# Altium project Micromouse2019.PrjPcb
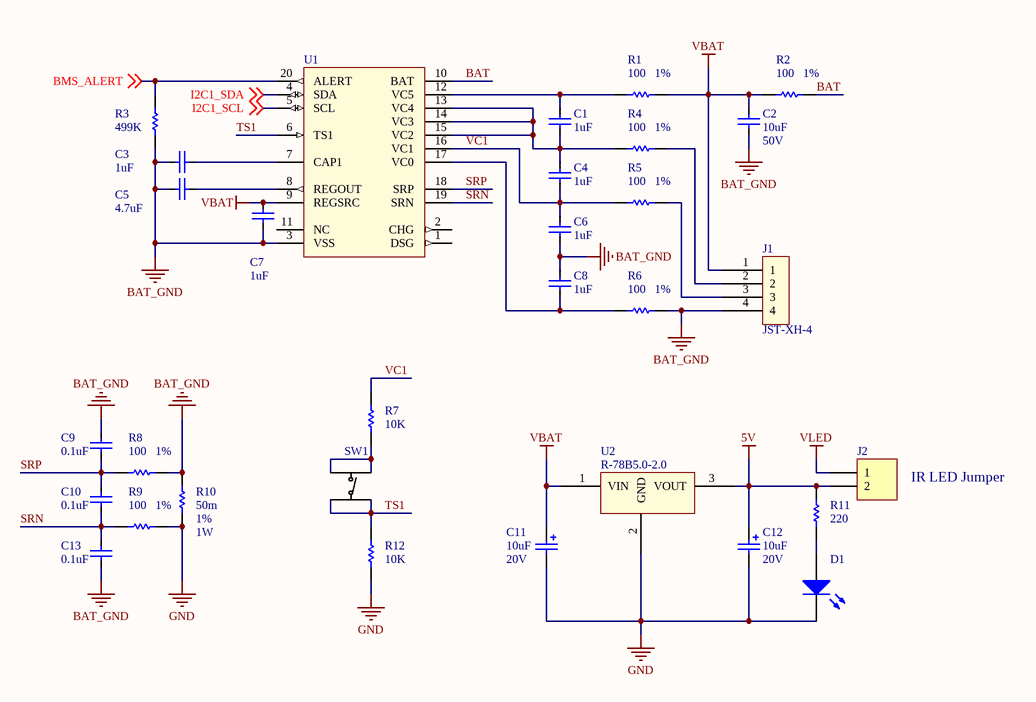
[diagram p0: Battery Management.SchDoc]
4 sheets, 84 parts. Net scope: global (net labels, ports and power ports of the same name join across sheets).
Board file: Micromouse2019.PcbDoc
Sheets:
  Battery Management.SchDoc
  Beaglebone.SchDoc
  Motor Drivers.SchDoc
  Peripherals.SchDoc

## Sheet Battery Management.SchDoc
size A

### Parts
C1  value 1uF  [C0805]  (hidden comment: CAP)
C2  value 10uF  Voltage - Rated: 50V  [1206]  (hidden comment: CAP)
C3  value 1uF  [C0805]  (hidden comment: CAP)
C4  value 1uF  [C0805]  (hidden comment: CAP)
C5  value 4.7uF  [C0805]  (hidden comment: CAP)
C6  value 1uF  [C0805]  (hidden comment: CAP)
C7  value 1uF  [C0805]  (hidden comment: CAP)
C8  value 1uF  [C0805]  (hidden comment: CAP)
C9  value 0.1uF  [J1-0603]  (hidden comment: CAP)
C10  value 0.1uF  [J1-0603]  (hidden comment: CAP)
C11  value 10uF  Voltage Rating: 20V  [1206+]  (hidden comment: CAP POL)
C12  value 10uF  Voltage Rating: 20V  [1206+]  (hidden comment: CAP POL)
C13  value 0.1uF  [J1-0603]  (hidden comment: CAP)
D1  LED  [0603-DI-GREEN]  (value not drawn)
J1  JST-XH-4  [JST-XH-4]
J2  Header 2  [HDR1X2]  (value not drawn)
R1  value 100  Tolerance: 1%  [J1-0603]
R2  value 100  Tolerance: 1%  [J1-0603]
R3  value 499K  [J1-0603]
R4  value 100  Tolerance: 1%  [J1-0603]
R5  value 100  Tolerance: 1%  [J1-0603]
R6  value 100  Tolerance: 1%  [J1-0603]
R7  value 10K  [J1-0603]
R8  value 100  Tolerance: 1%  [J1-0603]
R9  value 100  Tolerance: 1%  [J1-0603]
R10  value 50m  Tolerance: 1%  Power Rating: 1W  [RESC6332]
R11  value 220  [J1-0603]
R12  value 10K  [J1-0603]
SW1  TACT SWITCH  [TACT SWITCH]  (value not drawn)
U1  bq76920  [TSSOP20]  (value not drawn)
U2  Manufacturer Part Number: R-78B5.0-2.0  [SIP-3]  (hidden comment: R-78BXX-XX)

### Nets
5V: C12.1 J2.2 R11.1 U2.3(VOUT)
BAT_GND: C2.2 C3.1 C5.2 C6.1 C7.1 C8.2 C9.2 C13.1 J1.4 R3.1 R6.1 R8.1 R10.1 U1.3(VSS)
GND: C11.2 C12.2 D1.2(K) R9.1 R10.2 R12.2 U2.2(GND)
VBAT: C2.1 C7.2 C11.1 J1.1 R1.1 R2.2 U1.9(REGSRC) U2.1(VIN)
VLED: J2.1
BAT: R2.1 U1.10(BAT)
BMS_ALERT: R3.2 U1.20(ALERT) ; off-sheet BMS_ALERT
I2C1_SCL: U1.5(SCL) ; off-sheet I2C1_SCL
I2C1_SDA: U1.4(SDA) ; off-sheet I2C1_SDA
SRN: C10.1 C13.2 R9.2 U1.19(SRN)
SRP: C9.1 C10.2 R8.2 U1.18(SRP)
TS1: R12.1 SW1.3 SW1.4 U1.6(TS1)
VC1: C4.1 C6.2 R5.2 R7.1 U1.16(VC1)
NetC1_1: C1.1 C4.2 R4.2 U1.13(VC4) U1.14(VC3) U1.15(VC2)
NetC1_2: C1.2 R1.2 U1.12(VC5)
NetC3_2: C3.2 U1.7(CAP1)
NetC5_1: C5.1 U1.8(REGOUT)
NetC8_1: C8.1 R6.2 U1.17(VC0)
NetD1_1: D1.1(A) R11.2
NetJ1_2: J1.2 R4.1
NetJ1_3: J1.3 R5.1
NetR7_2: R7.2 SW1.1 SW1.2

Not connected (* = marked no-connect by the designer): U1 1(DSG) 2(CHG) 11(NC)

### Notes on the sheet
- IR LED Jumper

### Library data of the parts
C1 C3 C4 C6-C8 = CAP: CAP CER 1UF 25V X7R 0805; Manufacturer: Murata Electronics North America; Manufacturer Part Number: GCM21BR71E105KA56L; Tolerance: ±10%; Supplier 1: Digi-Key; Supplier Part Number 1: 490-4785-1-ND; RoHS: RoHS Compliant; Category: Capacitors; Stock 1: 30000; Pricing 1: 1=0.29, 10=0.198, 100=0.1122, 500=0.07918, 1000=0.06927 (USD); Packaging: Cut Tape (CT); Part Status: Active; Voltage - Rated: 25V; Temperature Coefficient: X7R; Operating Temperature: -55°C ~ 125°C; Features: -; Ratings: AEC-Q200; Applications: Automotive; Mounting Type: Surface Mount, MLCC; Package / Case: 0805 (2012 Metric); Size / Dimension: 0.079" L x 0.049" W (2.00mm x 1.25mm); Height - Seated (Max): -; Thickness (Max): 0.055" (1.40mm); Lead Spacing: -; Lead Style: -; ComponentLink1URL: http://search.murata.co.jp/Ceramy/image/img/A01X/G101/ENG/GCM21BR71E105KA56-01.pdf; ComponentLink1Description: http://search.murata.co.jp/Ceramy/image/img/A01X/G101/ENG/GCM21BR71E105KA56-01.pdf
C2 = CAP: CAP CER 10UF 50V X5R 1206; Manufacturer: Murata Electronics North America; Manufacturer Part Number: GRT31CR61H106KE01L; Tolerance: ±10%; Supplier 1: Digi-Key; Supplier Part Number 1: 490-12456-1-ND; RoHS: RoHS Compliant; Category: Capacitors; Stock 1: 20000; Pricing 1: 1=0.89, 10=0.633, 100=0.4166, 500=0.30856, 1000=0.26228 (USD); Packaging: Cut Tape (CT); Part Status: Active; Temperature Coefficient: X5R; Operating Temperature: -55°C ~ 85°C; Features: -; Ratings: AEC-Q200; Applications: Automotive; Mounting Type: Surface Mount, MLCC; Package / Case: 1206 (3216 Metric); Size / Dimension: 0.126" L x 0.063" W (3.20mm x 1.60mm); Height - Seated (Max): -; Thickness (Max): 0.071" (1.80mm); Lead Spacing: -; Lead Style: -; ComponentLink1URL: http://search.murata.co.jp/Ceramy/image/img/A01X/G101/ENG/GRT31CR61H106KE01-01.pdf; ComponentLink1Description: http://search.murata.co.jp/Ceramy/image/img/A01X/G101/ENG/GRT31CR61H106KE01-01.pdf
C5 = CAP: CAP CER 4.7UF 10V X7R 0805; Manufacturer: Samsung Electro-Mechanics; Manufacturer Part Number: CL21B475KPFNNNE; Tolerance: ±10%; Notification: Current market demand for these product types have resulted in fluctuating and extending lead times. Lead times may differ.; Supplier 1: Digi-Key; Supplier Part Number 1: 1276-2972-1-ND; RoHS: RoHS Compliant; Category: Capacitors; Stock 1: 20000; Pricing 1: 1=0.28, 10=0.19, 100=0.0963, 500=0.06588, 1000=0.05828 (USD); Packaging: Cut Tape (CT); Part Status: Active; Voltage - Rated: 10V; Temperature Coefficient: X7R; Operating Temperature: -55°C ~ 125°C; Features: -; Ratings: -; Applications: General Purpose; Mounting Type: Surface Mount, MLCC; Package / Case: 0805 (2012 Metric); Size / Dimension: 0.079" L x 0.049" W (2.00mm x 1.25mm); Height - Seated (Max): -; Thickness (Max): 0.053" (1.35mm); Lead Spacing: -; Lead Style: -; ComponentLink1URL: http://www.samsungsem.com/kr/support/product-search/mlcc/CL21B475KPFNNNE.jsp; ComponentLink1Description: http://www.samsungsem.com/kr/support/product-search/mlcc/CL21B475KPFNNNE.jsp
C9 C10 C13 = CAP: CAP CER 0.1UF 50V X7R 0603; Supplier Part Number 1: 399-6856-1-ND; Voltage Rating: 50V; Supplier 1: Digi-Key
C11 C12 = CAP POL: CAP TANT 10UF 10% 20V 1206; Published: 8-Jun-2000; LatestRevisionDate: 17-Jul-2002; LatestRevisionNote: Re-released for DXP Platform.; PackageReference: RB7.6-15; Publisher: Altium Limited; PackageDescription: Polarized Capacitor (Radial); 2 Leads; Supplier Part Number 1: 478-8273-1-ND; Supplier 1: Digi-Key
D1 = LED: LED GREEN CLEAR CHIP SMD; Published: 8-Jun-2000; LatestRevisionDate: 17-Jul-2002; LatestRevisionNote: Re-released for DXP Platform.; PackageVersion: Feb-2002; PackageReference: 3.2X1.6X1.1; Publisher: Altium Limited; PackageDescription: SM LED; 2 Flat Leads; Supplier Part Number 1: 160-1888-1-ND; Supplier 1: Digi-Key
J1 = JST-XH-4: CONN HEADER R/A 4POS 2.5MM; Manufacturer: JST Sales America Inc.; Manufacturer Part Number: S4B-XH-A(LF)(SN); Pitch - Mating: 0.098" (2.50mm); Number of Positions: 4; Number of Positions Loaded: All; Style: Board to Cable/Wire; Shrouding: Shrouded - 4 Wall; Contact Length - Post: 0.134" (3.40mm); Material Flammability Rating: UL94 V-0; Current Rating: 3A; Voltage Rating: 250V; Mated Stacking Heights: 6.1mm; Supplier 1: Digi-Key; RoHS: RoHS Compliant; Category: Connectors, Interconnects; Stock 1: 46156; Pricing 1: 1=0.27, 10=0.257, 100=0.1785, 500=0.151, 1000=0.12355, 5000=0.10982, 10000=0.09953 (USD); Packaging: Bulk; Part Status: Active; Connector Type: Header; Contact Type: Male Pin; Number of Rows: 1; Row Spacing - Mating: -; Mounting Type: Through Hole, Right Angle; Termination: Press-Fit, Solder; Fastening Type: Detent Lock; Contact Length - Mating: -; Overall Contact Length: -; Insulation Height: 0.240" (6.10mm); Contact Shape: Square; Contact Finish - Mating: Tin; Contact Finish Thickness - Mating: -; Contact Finish - Post: Tin; Contact Material: Brass; Insulation Material: Polyamide (PA66), Nylon 6/6; Features: -; Operating Temperature: -25°C ~ 85°C; Ingress Protection: -; Insulation Color: Natural; Contact Finish Thickness - Post: -; Applications: -; ComponentLink1URL: http://www.jst-mfg.com/product/pdf/eng/eXH.pdf; ComponentLink1Description: http://www.jst-mfg.com/product/pdf/eng/eXH.pdf; Supplier Part Number 1: 455-2243-ND
J2 = Header 2: Header, 2-Pin; LatestRevisionDate: 17-Jul-2002; LatestRevisionNote: Re-released for DXP Platform.; Publisher: Altium Limited
R1 R2 R4-R6 R8 R9 = Res1: RES SMD 100 OHM 1% 1/10W 0603; Supplier Part Number 1: 311-100HRCT-ND; Supplier 1: Digi-Key
R3 = Res1: RES SMD 499K OHM 1% 1/10W 0603; Supplier Part Number 1: 311-499KHRCT-ND; Supplier 1: Digi-Key
R7 R12 = Res1: RES SMD 10K OHM 5% 1/10W 0603; Supplier Part Number 1: 311-10KGRCT-ND; Supplier 1: Digi-Key
R10 = Res1: RES 0.05 OHM 1% 1W 2512; Supplier Part Number 1: 311-0.05TCT-ND; Supplier 1: Digi-Key
R11 = Res1: RES SMD 220 OHM 5% 1/10W 0603; Supplier Part Number 1: 311-220GRCT-ND; Supplier 1: Digi-Key
SW1 = TACT SWITCH: SWITCH TACTILE SPST-NO 0.05A 12V; Manufacturer: C&K; Manufacturer Part Number: PTS645SL50SMTR92 LFS; Switch Function: Off-Mom; Contact Rating @ Voltage: 0.05A @ 12VDC; Actuator Type: Standard; Actuator Height off PCB, Vertical: 5.00mm; Actuator Orientation: Top Actuated; Outline: 6.00mm x 6.00mm; Illumination: Non-Illuminated; Operating Force: 130gf; Actuator Material: Polyamide (PA66), Nylon 6/6; Mechanical Life: 100,000 Cycles; Supplier 1: Digi-Key; RoHS: RoHS Compliant; Category: Switches; Stock 1: 42939; Pricing 1: 1=0.22, 10=0.215, 25=0.2076, 50=0.2002, 100=0.1891, 250=0.17796, 500=0.17054 (USD); Packaging: Cut Tape (CT); Part Status: Active; Circuit: SPST-NO; Mounting Type: Surface Mount; Actuator Length, Right Angle: -; Termination Style: Gull Wing; Illumination Type, Color: -; Illumination Voltage (Nominal): -; Ingress Protection: -; Features: -; Operating Temperature: -20°C ~ 60°C; Switch Travel: -; ComponentLink1URL: https://www.ckswitches.com/media/1471/pts645.pdf; ComponentLink1Description: https://www.ckswitches.com/media/1471/pts645.pdf; Supplier Part Number 1: CKN9088CT-ND
U1 = bq76920: IC BATT MGMT LI-ION AFE 20TSSOP; Supplier 1: Digi-Key; Supplier Part Number 1: 296-39960-1-ND
U2 = R-78BXX-XX: DC DC CONVERTER 5V; Manufacturer: Recom Power; Voltage - Input (Min): 6.5V; Voltage - Input (Max): 32V; Current - Output (Max): 2A; Efficiency: 94%; Supplier 1: Digi-Key; Supplier Part Number 1: 945-3042-ND; RoHS: RoHS Compliant; Category: Power Supplies - Board Mount; Stock 1: 3257; Pricing 1: 1=9.87, 5=9.792, 10=9.718, 42=9.5681, 84=9.26905, 126=8.37198, 252=8.2225, 504=8.073 (USD); Packaging: Tube; Part Status: Active; Type: Linear Regulator Replacement; Voltage - Output 1: 5V; Voltage - Output 2: -; Voltage - Output 3: -; Applications: ITE (Commercial); Features: OTP, SCP; Operating Temperature: -40°C ~ 70°C; Mounting Type: Through Hole; Package / Case: 3-SIP Module; Size / Dimension: 0.45" L x 0.33" W x 0.69" H (11.5mm x 8.5mm x 17.5mm); Supplier Device Package: -; Control Features: -; ComponentLink1URL: https://www.recom-power.com/pdf/Innoline/R-78Bxx-2.0.pdf; ComponentLink1Description: https://www.recom-power.com/pdf/Innoline/R-78Bxx-2.0.pdf

## Sheet Beaglebone.SchDoc
size A
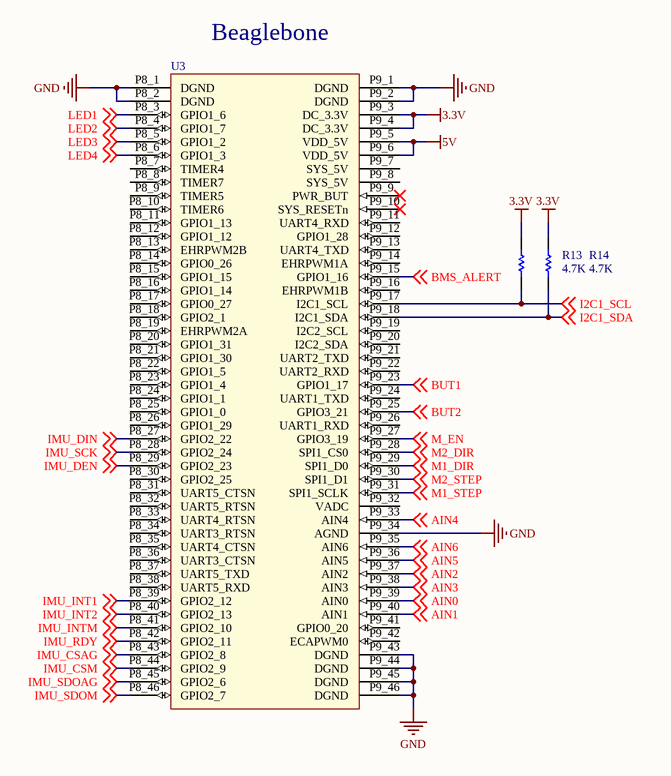
[diagram p1: Beaglebone.SchDoc]

### Parts
R13  value 4.7K  [J1-0603]
R14  value 4.7K  [J1-0603]
U3  Beaglebone Black  [BEAGLEBONE_BLACK]  (value not drawn)

### Nets
3.3V: R13.2 R14.2 U3.P9_3(DC_3.3V) U3.P9_4(DC_3.3V)
5V: U3.P9_5(VDD_5V) U3.P9_6(VDD_5V)
GND: U3.P8_1(DGND) U3.P8_2(DGND) U3.P9_1(DGND) U3.P9_2(DGND) U3.P9_34(AGND) U3.P9_43(DGND) U3.P9_44(DGND) U3.P9_45(DGND) U3.P9_46(DGND)
AIN0: U3.P9_39(AIN0) ; off-sheet AIN0
AIN1: U3.P9_40(AIN1) ; off-sheet AIN1
AIN2: U3.P9_37(AIN2) ; off-sheet AIN2
AIN3: U3.P9_38(AIN3) ; off-sheet AIN3
AIN4: U3.P9_33(AIN4) ; off-sheet AIN4
AIN5: U3.P9_36(AIN5) ; off-sheet AIN5
AIN6: U3.P9_35(AIN6) ; off-sheet AIN6
BMS_ALERT: U3.P9_15(GPIO1_16) ; off-sheet BMS_ALERT
BUT1: U3.P9_23(GPIO1_17) ; off-sheet BUT1
BUT2: U3.P9_25(GPIO3_21) ; off-sheet BUT2
I2C1_SCL: R13.1 U3.P9_17(I2C1_SCL) ; off-sheet I2C1_SCL
I2C1_SDA: R14.1 U3.P9_18(I2C1_SDA) ; off-sheet I2C1_SDA
IMU_CSAG: U3.P8_43(GPIO2_8) ; off-sheet IMU_CSAG
IMU_CSM: U3.P8_44(GPIO2_9) ; off-sheet IMU_CSM
IMU_DEN: U3.P8_29(GPIO2_23) ; off-sheet IMU_DEN
IMU_DIN: U3.P8_27(GPIO2_22) ; off-sheet IMU_DIN
IMU_INT1: U3.P8_39(GPIO2_12) ; off-sheet IMU_INT1
IMU_INT2: U3.P8_40(GPIO2_13) ; off-sheet IMU_INT2
IMU_INTM: U3.P8_41(GPIO2_10) ; off-sheet IMU_INTM
IMU_RDY: U3.P8_42(GPIO2_11) ; off-sheet IMU_RDY
IMU_SCK: U3.P8_28(GPIO2_24) ; off-sheet IMU_SCK
IMU_SDOAG: U3.P8_45(GPIO2_6) ; off-sheet IMU_SDOAG
IMU_SDOM: U3.P8_46(GPIO2_7) ; off-sheet IMU_SDOM
LED1: U3.P8_3(GPIO1_6) ; off-sheet LED1
LED2: U3.P8_4(GPIO1_7) ; off-sheet LED2
LED3: U3.P8_5(GPIO1_2) ; off-sheet LED3
LED4: U3.P8_6(GPIO1_3) ; off-sheet LED4
M1_DIR: U3.P9_29(SPI1_D0) ; off-sheet M1_DIR
M1_STEP: U3.P9_31(SPI1_SCLK) ; off-sheet M1_STEP
M2_DIR: U3.P9_28(SPI1_CS0) ; off-sheet M2_DIR
M2_STEP: U3.P9_30(SPI1_D1) ; off-sheet M2_STEP
M_EN: U3.P9_27(GPIO3_19) ; off-sheet M_EN

Not connected (* = marked no-connect by the designer): U3 P8_7(TIMER4) P8_8(TIMER7) P8_9(TIMER5) P8_10(TIMER6) P8_11(GPIO1_13) P8_12(GPIO1_12) P8_13(EHRPWM2B) P8_14(GPIO0_26) P8_15(GPIO1_15) P8_16(GPIO1_14) P8_17(GPIO0_27) P8_18(GPIO2_1) P8_19(EHRPWM2A) P8_20(GPIO1_31) P8_21(GPIO1_30) P8_22(GPIO1_5) P8_23(GPIO1_4) P8_24(GPIO1_1) P8_25(GPIO1_0) P8_26(GPIO1_29) P8_30(GPIO2_25) P8_31(UART5_CTSN) P8_32(UART5_RTSN) P8_33(UART4_RTSN) P8_34(UART3_RTSN) P8_35(UART4_CTSN) P8_36(UART3_CTSN) P8_37(UART5_TXD) P8_38(UART5_RXD) P9_7(SYS_5V) P9_8(SYS_5V) P9_9(PWR_BUT)* P9_10(SYS_RESETn)* P9_11(UART4_RXD) P9_12(GPIO1_28) P9_13(UART4_TXD) P9_14(EHRPWM1A) P9_16(EHRPWM1B) P9_19(I2C2_SCL) P9_20(I2C2_SDA) P9_21(UART2_TXD) P9_22(UART2_RXD) P9_24(UART1_TXD) P9_26(UART1_RXD) P9_32(VADC) P9_41(GPIO0_20) P9_42(ECAPWM0)

### Notes on the sheet
- (near U3) Beaglebone

### Library data of the parts
R13 R14 = Res1: RES SMD 4.7K OHM 5% 1/10W 0603; Supplier Part Number 1: 311-4.7KGRCT-ND; Supplier 1: Digi-Key

## Sheet Motor Drivers.SchDoc
size A
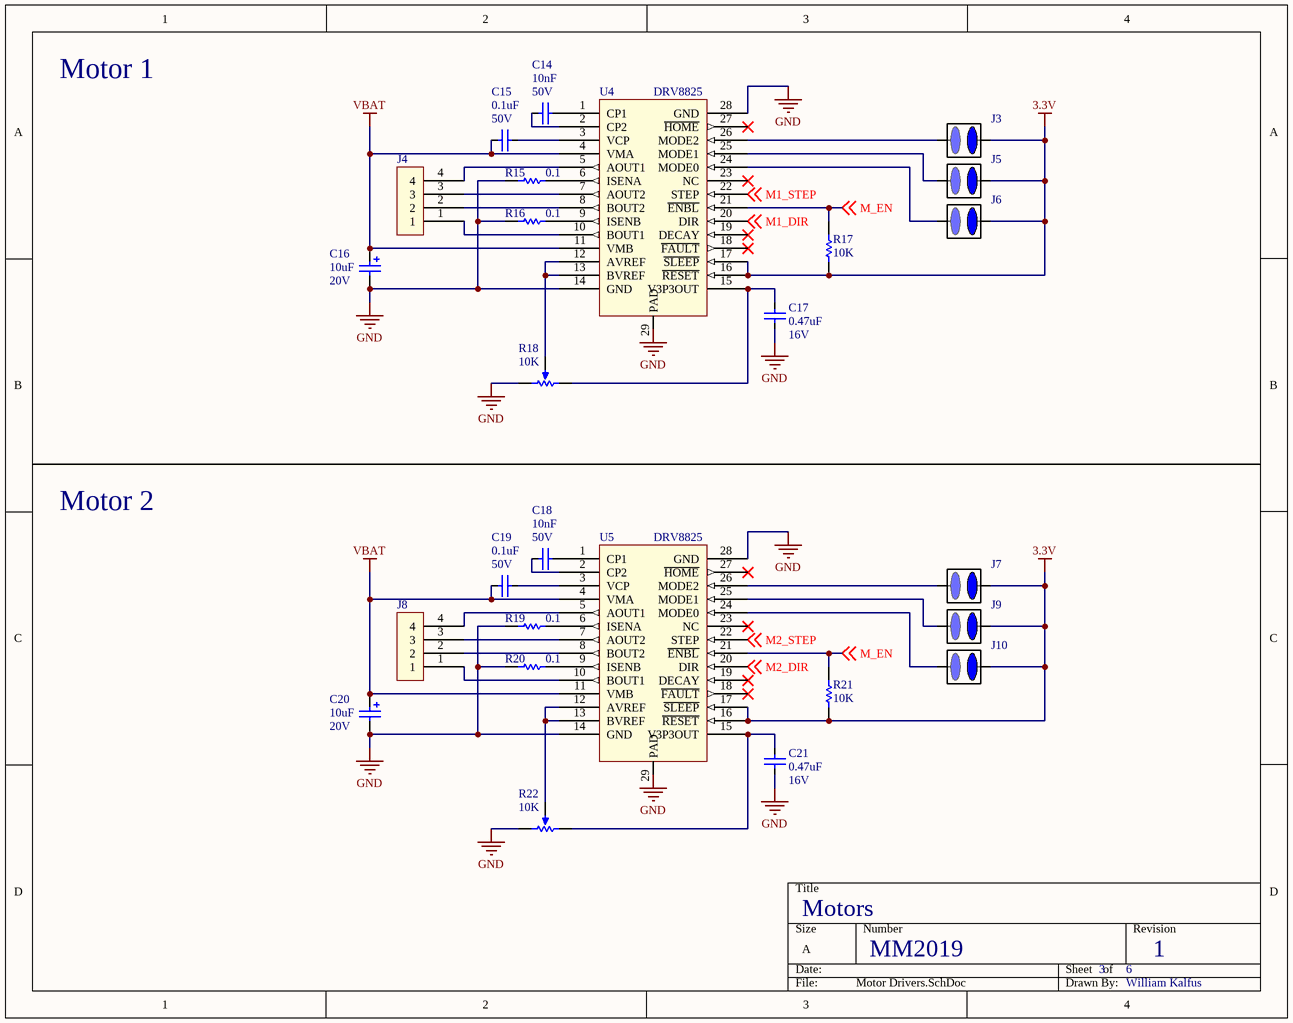
[diagram p2: Motor Drivers.SchDoc]

### Parts
C14  value 10nF  Voltage Rating: 50V  [J1-0603]  (hidden comment: CAP)
C15  value 0.1uF  Voltage Rating: 50V  [J1-0603]  (hidden comment: CAP)
C16  value 10uF  Voltage Rating: 20V  [1206+]  (hidden comment: CAP POL)
C17  value 0.47uF  Voltage Rating: 16V  [J1-0603]  (hidden comment: CAP)
C18  value 10nF  Voltage Rating: 50V  [J1-0603]  (hidden comment: CAP)
C19  value 0.1uF  Voltage Rating: 50V  [J1-0603]  (hidden comment: CAP)
C20  value 10uF  Voltage Rating: 20V  [1206+]  (hidden comment: CAP POL)
C21  value 0.47uF  Voltage Rating: 16V  [J1-0603]  (hidden comment: CAP)
J3  JUMPER  [JUMPER]  (value not drawn)
J4  CONN_4x1  [CONN_4x1]  (value not drawn)
J5  JUMPER  [JUMPER]  (value not drawn)
J6  JUMPER  [JUMPER]  (value not drawn)
J7  JUMPER  [JUMPER]  (value not drawn)
J8  CONN_4x1  [CONN_4x1]  (value not drawn)
J9  JUMPER  [JUMPER]  (value not drawn)
J10  JUMPER  [JUMPER]  (value not drawn)
R15  value 0.1  [J1-0603]
R16  value 0.1  [J1-0603]
R17  value 10K  [J1-0603]
R18  value 10K  [ST32-EB]  (hidden comment: POT ST32ETB103)
R19  value 0.1  [J1-0603]
R20  value 0.1  [J1-0603]
R21  value 10K  [J1-0603]
R22  value 10K  [ST32-EB]  (hidden comment: POT ST32ETB103)
U4  DRV8825  [PP28]
U5  DRV8825  [PP28]

### Nets
3.3V: J3.2 J5.2 J6.2 J7.2 J9.2 J10.2 R17.2 R21.2 U4.16(~{RESET}) U4.17(~{SLEEP}) U5.16(~{RESET}) U5.17(~{SLEEP})
GND: C16.2 C17.2 C20.2 C21.2 R15.2 R16.2 R18.3(BOT) R19.2 R20.2 R22.3(BOT) U4.14(GND) U4.28(GND) U4.29(PAD) U5.14(GND) U5.28(GND) U5.29(PAD)
VBAT: C15.2 C16.1 C19.2 C20.1 U4.4(VMA) U4.11(VMB) U5.4(VMA) U5.11(VMB)
M1_DIR: U4.20(DIR) ; off-sheet M1_DIR
M1_STEP: U4.22(STEP) ; off-sheet M1_STEP
M2_DIR: U5.20(DIR) ; off-sheet M2_DIR
M2_STEP: U5.22(STEP) ; off-sheet M2_STEP
M_EN: R17.1 R21.1 U4.21(~{ENBL}) U5.21(~{ENBL}) ; off-sheet M_EN
NetC14_1: C14.1 U4.1(CP1)
NetC14_2: C14.2 U4.2(CP2)
NetC15_1: C15.1 U4.3(VCP)
NetC17_1: C17.1 R18.1(TOP) U4.15(V3P3OUT)
NetC18_1: C18.1 U5.1(CP1)
NetC18_2: C18.2 U5.2(CP2)
NetC19_1: C19.1 U5.3(VCP)
NetC21_1: C21.1 R22.1(TOP) U5.15(V3P3OUT)
NetJ3_1: J3.1 U4.26(MODE2)
NetJ4_1: J4.1 U4.10(BOUT1)
NetJ4_2: J4.2 U4.8(BOUT2)
NetJ4_3: J4.3 U4.7(AOUT2)
NetJ4_4: J4.4 U4.5(AOUT1)
NetJ5_1: J5.1 U4.25(MODE1)
NetJ6_1: J6.1 U4.24(MODE0)
NetJ7_1: J7.1 U5.26(MODE2)
NetJ8_1: J8.1 U5.10(BOUT1)
NetJ8_2: J8.2 U5.8(BOUT2)
NetJ8_3: J8.3 U5.7(AOUT2)
NetJ8_4: J8.4 U5.5(AOUT1)
NetJ9_1: J9.1 U5.25(MODE1)
NetJ10_1: J10.1 U5.24(MODE0)
NetR15_1: R15.1 U4.6(ISENA)
NetR16_1: R16.1 U4.9(ISENB)
NetR18_2: R18.2(TAP) U4.12(AVREF) U4.13(BVREF)
NetR19_1: R19.1 U5.6(ISENA)
NetR20_1: R20.1 U5.9(ISENB)
NetR22_2: R22.2(TAP) U5.12(AVREF) U5.13(BVREF)

Not connected (* = marked no-connect by the designer): U4 18(~{FAULT})* 19(DECAY)* 23(NC)* 27(~{HOME})*; U5 18(~{FAULT})* 19(DECAY)* 23(NC)* 27(~{HOME})*

### Notes on the sheet
- Motor 1
- Motor 2
- Motors
- MM2019
- 3
- 6
- 1
- William Kalfus

### Library data of the parts
C14 C18 = CAP: CAP CER 10000PF 50V X7R 0603; Supplier Part Number 1: 311-1085-1-ND; Supplier 1: Digi-Key
C15 C19 = CAP: CAP CER 0.1UF 50V X7R 0603; Supplier Part Number 1: 399-6856-1-ND; Supplier 1: Digi-Key
C16 C20 = CAP POL: CAP TANT 10UF 10% 20V 1206; Published: 8-Jun-2000; LatestRevisionDate: 17-Jul-2002; LatestRevisionNote: Re-released for DXP Platform.; PackageReference: RB7.6-15; Publisher: Altium Limited; PackageDescription: Polarized Capacitor (Radial); 2 Leads; Supplier Part Number 1: 478-8273-1-ND; Supplier 1: Digi-Key
C17 C21 = CAP: CAP CER 0.47UF 16V X7R 0603; Supplier Part Number 1: 490-3295-1-ND; Supplier 1: Digi-Key
J4 J8 = CONN_4x1: CONN HEADER 4POS .100 R/A 30AU; Manufacturer: Amphenol FCI; Manufacturer Part Number: 68016-104HLF; Pitch - Mating: 0.100" (2.54mm); Number of Positions: 4; Number of Positions Loaded: All; Style: Board to Board; Shrouding: Unshrouded; Contact Length - Mating: 0.230" (5.84mm); Contact Length - Post: 0.120" (3.05mm); Material Flammability Rating: UL94 V-0; Supplier 1: Digi-Key; Supplier Part Number 1: 609-3312-ND; RoHS: RoHS Compliant; Category: Connectors, Interconnects; Stock 1: 5255; Pricing 1: 1=0.41, 10=0.385, 100=0.2697, 500=0.23122, 1000=0.19268, 5000=0.16515, 10000=0.15414 (USD); Packaging: Bulk; Part Status: Active; Connector Type: Header; Contact Type: Male Pin; Number of Rows: 1; Row Spacing - Mating: -; Mounting Type: Through Hole, Right Angle; Termination: Solder; Fastening Type: Push-Pull; Overall Contact Length: -; Insulation Height: 0.095" (2.41mm); Contact Shape: Square; Contact Finish - Mating: Gold or Gold, GXT™; Contact Finish Thickness - Mating: 30µin (0.76µm); Contact Finish - Post: -; Contact Material: Phosphor Bronze; Insulation Material: -; Features: -; Operating Temperature: -; Ingress Protection: -; Insulation Color: Black; Current Rating: -; Voltage Rating: -; Mated Stacking Heights: -; Contact Finish Thickness - Post: -; Applications: -; ComponentLink1URL: http://cdn.amphenol-icc.com/media/wysiwyg/files/drawing/68015.pdf; ComponentLink1Description: http://cdn.amphenol-icc.com/media/wysiwyg/files/drawing/68015.pdf
R15 R16 R19 R20 = Res1: RES 0.1 OHM 1% 1/3W 0603; Supplier Part Number 1: P17478CT-ND; Supplier 1: Digi-Key
R17 R21 = Res1: RES SMD 10K OHM 5% 1/10W 0603; Supplier Part Number 1: 311-10KGRCT-ND; Supplier 1: Digi-Key
R18 R22 = POT ST32ETB103: 10K Trimmer Potentiometer; Sim Note: Enter the Resistance value and the set point into parameter fields.; Set Position: 0.5; Published: 8-Jun-2000; LatestRevisionDate: 17-Jul-2002; LatestRevisionNote: Re-released for DXP Platform.; PackageReference: VR5; Publisher: Altium Limited; PackageDescription: Variable Resistor, Thru-Hole; 3 Leads; Supplier 1: Digi-Key; Supplier Part Number 1: ST32ETB103CT-ND
U4 U5 = DRV8825: IC MOTOR DRIVER PAR 28HTSSOP; Manufacturer: Texas Instruments; Manufacturer Part Number: DRV8825PWPR; Motor Type - Stepper: Bipolar; Function: Driver - Fully Integrated, Control and Power Stage; Output Configuration: Half Bridge (4); Interface: Logic; Step Resolution: 1 ~ 1/32; Current - Output: 2.5A; Voltage - Supply: 8.2 V ~ 45 V; Supplier 1: Digi-Key; Supplier Part Number 1: 296-29503-1-ND; RoHS: RoHS Compliant; Category: Integrated Circuits (ICs); Stock 1: 21013; Pricing 1: 1=3.93, 10=3.53, 100=2.8922, 500=2.46212, 1000=2.07648 (USD); Packaging: Cut Tape (CT); Part Status: Active; Motor Type - AC, DC: -; Technology: Power MOSFET; Applications: General Purpose; Voltage - Load: 8.2 V ~ 45 V; Operating Temperature: -40°C ~ 150°C (TJ); Mounting Type: Surface Mount; Package / Case: 28-TSSOP (0.173", 4.40mm Width) Exposed Pad; Supplier Device Package: 28-HTSSOP; ComponentLink1URL: http://www.ti.com/lit/ds/symlink/drv8825.pdf; ComponentLink1Description: http://www.ti.com/lit/ds/symlink/drv8825.pdf

## Sheet Peripherals.SchDoc
size A
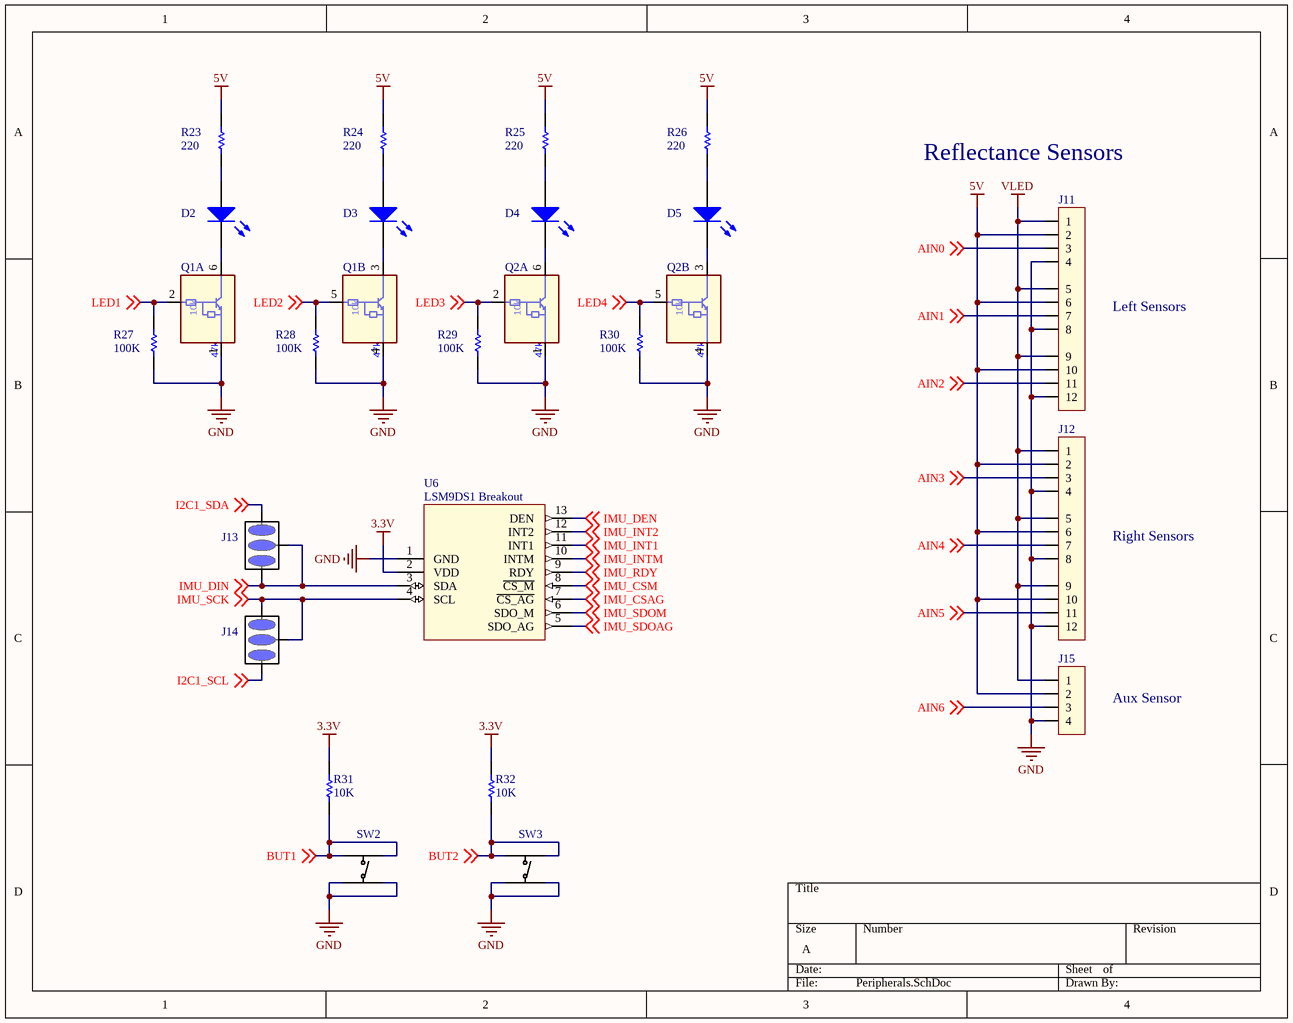
[diagram p3: Peripherals.SchDoc]

### Parts
D2  LED  [0603-DI-GREEN]  (value not drawn)
D3  LED  [0603-DI-GREEN]  (value not drawn)
D4  LED  [0603-DI-GREEN]  (value not drawn)
D5  LED  [0603-DI-GREEN]  (value not drawn)
J11  CONN_4x3  [CONN_4x3]  (value not drawn)
J12  CONN_4x3  [CONN_4x3]  (value not drawn)
J13  JUMPER_3  [JUMPER_3]  (value not drawn)
J14  JUMPER_3  [JUMPER_3]  (value not drawn)
J15  CONN_4x1  [HDR1X4]  (value not drawn)
Q1  RN1907  [SOT363-6L]  (value not drawn)  (parts A,B of 2)
Q2  RN1907  [SOT363-6L]  (value not drawn)  (parts A,B of 2)
R23  value 220  [J1-0603]
R24  value 220  [J1-0603]
R25  value 220  [J1-0603]
R26  value 220  [J1-0603]
R27  value 100K  [J1-0603]
R28  value 100K  [J1-0603]
R29  value 100K  [J1-0603]
R30  value 100K  [J1-0603]
R31  value 10K  [J1-0603]
R32  value 10K  [J1-0603]
SW2  TACT SWITCH  [TACT SWITCH]  (value not drawn)
SW3  TACT SWITCH  [TACT SWITCH]  (value not drawn)
U6  LSM9DS1 Breakout  [LSM9DS1 Breakout]

### Nets
3.3V: R31.1 R32.1 U6.2(VDD)
5V: J11.2 J11.6 J11.10 J12.2 J12.6 J12.10 J15.2 R23.2 R24.2 R25.2 R26.2
GND: J11.4 J11.8 J11.12 J12.4 J12.8 J12.12 J15.4 Q1.1 Q1.4 Q2.1 Q2.4 R27.1 R28.1 R29.1 R30.1 SW2.3 SW2.4 SW3.3 SW3.4 U6.1(GND)
VLED: J11.1 J11.5 J11.9 J12.1 J12.5 J12.9 J15.1
AIN0: J11.3 ; off-sheet AIN0
AIN1: J11.7 ; off-sheet AIN1
AIN2: J11.11 ; off-sheet AIN2
AIN3: J12.3 ; off-sheet AIN3
AIN4: J12.7 ; off-sheet AIN4
AIN5: J12.11 ; off-sheet AIN5
AIN6: J15.3 ; off-sheet AIN6
BUT1: R31.2 SW2.1 SW2.2 ; off-sheet BUT1
BUT2: R32.2 SW3.1 SW3.2 ; off-sheet BUT2
I2C1_SCL: J14.1 ; off-sheet I2C1_SCL
I2C1_SDA: J13.3 ; off-sheet I2C1_SDA
IMU_CSAG: U6.7(~{CS_AG}) ; off-sheet IMU_CSAG
IMU_CSM: U6.8(~{CS_M}) ; off-sheet IMU_CSM
IMU_DEN: U6.13(DEN) ; off-sheet IMU_DEN
IMU_DIN: J13.1 J13.2 U6.3(SDA) ; off-sheet IMU_DIN
IMU_INT1: U6.11(INT1) ; off-sheet IMU_INT1
IMU_INT2: U6.12(INT2) ; off-sheet IMU_INT2
IMU_INTM: U6.10(INTM) ; off-sheet IMU_INTM
IMU_RDY: U6.9(RDY) ; off-sheet IMU_RDY
IMU_SCK: J14.2 J14.3 U6.4(SCL) ; off-sheet IMU_SCK
IMU_SDOAG: U6.5(SDO_AG) ; off-sheet IMU_SDOAG
IMU_SDOM: U6.6(SDO_M) ; off-sheet IMU_SDOM
LED1: Q1.2 R27.2 ; off-sheet LED1
LED2: Q1.5 R28.2 ; off-sheet LED2
LED3: Q2.2 R29.2 ; off-sheet LED3
LED4: Q2.5 R30.2 ; off-sheet LED4
NetD2_1: D2.1(A) R23.1
NetD2_2: D2.2(K) Q1.6
NetD3_1: D3.1(A) R24.1
NetD3_2: D3.2(K) Q1.3
NetD4_1: D4.1(A) R25.1
NetD4_2: D4.2(K) Q2.6
NetD5_1: D5.1(A) R26.1
NetD5_2: D5.2(K) Q2.3

### Notes on the sheet
- Reflectance Sensors
- Left Sensors
- Right Sensors
- Aux Sensor
- (in symbol RN1907, part A) 10k; 47k
- (in symbol RN1907, part B) 10k; 47k

### Library data of the parts
D2-D5 = LED: LED BLUE CLEAR CHIP SMD; Published: 8-Jun-2000; LatestRevisionDate: 17-Jul-2002; LatestRevisionNote: Re-released for DXP Platform.; PackageVersion: Feb-2002; PackageReference: 3.2X1.6X1.1; Publisher: Altium Limited; PackageDescription: SM LED; 2 Flat Leads; Supplier Part Number 1: 160-1647-1-ND; Supplier 1: Digi-Key
J11 J12 = CONN_4x3: CONN HEADER R/A 12POS 2.54MM; Supplier Part Number 1: SAM8998-ND; Supplier 1: Digi-Key
Q1 Q2 = RN1907: TRANS 2NPN PREBIAS 0.2W US6; Supplier Part Number 1: RN1907LF(CTCT-ND; Supplier 1: Digi-Key
R23-R26 = Res1: RES SMD 220 OHM 5% 1/10W 0603; Supplier Part Number 1: 311-220GRCT-ND; Supplier 1: Digi-Key
R27-R30 = Res1: RES SMD 100K OHM 5% 1/10W 0603; Supplier Part Number 1: 311-100KGRCT-ND; Supplier 1: Digi-Key
R31 R32 = Res1: RES SMD 10K OHM 5% 1/10W 0603; Supplier Part Number 1: 311-10KGRCT-ND; Supplier 1: Digi-Key
SW2 SW3 = TACT SWITCH: as SW1 on sheet Battery Management; Supplier 1: Digi-Key; RoHS: RoHS Compliant; Category: Switches; Stock 1: 42939; Pricing 1: 1=0.22, 10=0.215, 25=0.2076, 50=0.2002, 100=0.1891, 250=0.17796, 500=0.17054 (USD); Packaging: Cut Tape (CT); Part Status: Active; Circuit: SPST-NO; Mounting Type: Surface Mount; Actuator Length, Right Angle: -; Termination Style: Gull Wing; Illumination Type, Color: -; Illumination Voltage (Nominal): -; Ingress Protection: -; Features: -; Operating Temperature: -20°C ~ 60°C; Switch Travel: -; ComponentLink1URL: https://www.ckswitches.com/media/1471/pts645.pdf; ComponentLink1Description: https://www.ckswitches.com/media/1471/pts645.pdf; Supplier Part Number 1: CKN9088CT-ND
U6 = LSM9DS1 Breakout: SPARKFUN 9 DEGREES OF FREEDOM IM; Supplier Part Number 1: 1568-1257-ND; Supplier 1: Digi-Key

## Nets that join several sheets
3.3V: Beaglebone (R13.2 R14.2 U3.P9_3 U3.P9_4), Motor Drivers (12 pins), Peripherals (R31.1 R32.1 U6.2)
5V: Battery Management (C12.1 J2.2 R11.1 U2.3), Beaglebone (U3.P9_5 U3.P9_6), Peripherals (11 pins)
GND: Battery Management (7 pins), Beaglebone (9 pins), Motor Drivers (16 pins), Peripherals (20 pins)
VBAT: Battery Management (8 pins), Motor Drivers (8 pins)
VLED: Battery Management (J2.1), Peripherals (7 pins)
AIN0: Beaglebone (U3.P9_39), Peripherals (J11.3)
AIN1: Beaglebone (U3.P9_40), Peripherals (J11.7)
AIN2: Beaglebone (U3.P9_37), Peripherals (J11.11)
AIN3: Beaglebone (U3.P9_38), Peripherals (J12.3)
AIN4: Beaglebone (U3.P9_33), Peripherals (J12.7)
AIN5: Beaglebone (U3.P9_36), Peripherals (J12.11)
AIN6: Beaglebone (U3.P9_35), Peripherals (J15.3)
BMS_ALERT: Battery Management (R3.2 U1.20), Beaglebone (U3.P9_15)
BUT1: Beaglebone (U3.P9_23), Peripherals (R31.2 SW2.1 SW2.2)
BUT2: Beaglebone (U3.P9_25), Peripherals (R32.2 SW3.1 SW3.2)
I2C1_SCL: Battery Management (U1.5), Beaglebone (R13.1 U3.P9_17), Peripherals (J14.1)
I2C1_SDA: Battery Management (U1.4), Beaglebone (R14.1 U3.P9_18), Peripherals (J13.3)
IMU_CSAG: Beaglebone (U3.P8_43), Peripherals (U6.7)
IMU_CSM: Beaglebone (U3.P8_44), Peripherals (U6.8)
IMU_DEN: Beaglebone (U3.P8_29), Peripherals (U6.13)
IMU_DIN: Beaglebone (U3.P8_27), Peripherals (J13.1 J13.2 U6.3)
IMU_INT1: Beaglebone (U3.P8_39), Peripherals (U6.11)
IMU_INT2: Beaglebone (U3.P8_40), Peripherals (U6.12)
IMU_INTM: Beaglebone (U3.P8_41), Peripherals (U6.10)
IMU_RDY: Beaglebone (U3.P8_42), Peripherals (U6.9)
IMU_SCK: Beaglebone (U3.P8_28), Peripherals (J14.2 J14.3 U6.4)
IMU_SDOAG: Beaglebone (U3.P8_45), Peripherals (U6.5)
IMU_SDOM: Beaglebone (U3.P8_46), Peripherals (U6.6)
LED1: Beaglebone (U3.P8_3), Peripherals (Q1.2 R27.2)
LED2: Beaglebone (U3.P8_4), Peripherals (Q1.5 R28.2)
LED3: Beaglebone (U3.P8_5), Peripherals (Q2.2 R29.2)
LED4: Beaglebone (U3.P8_6), Peripherals (Q2.5 R30.2)
M1_DIR: Beaglebone (U3.P9_29), Motor Drivers (U4.20)
M1_STEP: Beaglebone (U3.P9_31), Motor Drivers (U4.22)
M2_DIR: Beaglebone (U3.P9_28), Motor Drivers (U5.20)
M2_STEP: Beaglebone (U3.P9_30), Motor Drivers (U5.22)
M_EN: Beaglebone (U3.P9_27), Motor Drivers (R17.1 R21.1 U4.21 U5.21)